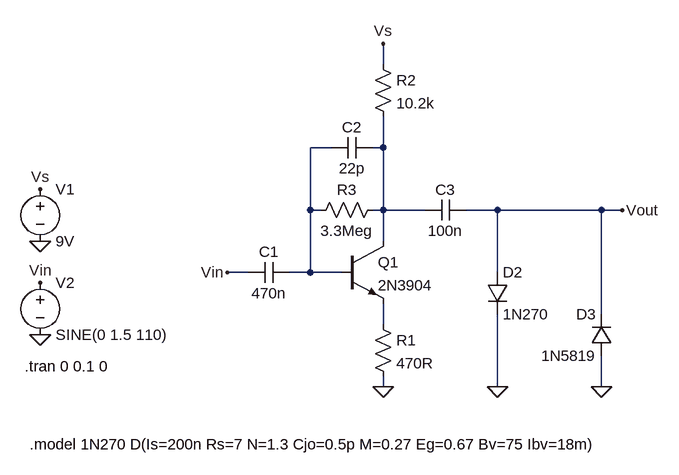
[diagram p0: schematic Electra_2.asc]
Electra_2.asc, the LTspice schematic file:
Version 4.1
SHEET 1 1988 680
WIRE 528 -32 528 -64
WIRE 448 96 416 96
WIRE 528 96 528 48
WIRE 528 96 512 96
WIRE 416 192 416 96
WIRE 432 192 416 192
WIRE 528 192 528 96
WIRE 528 192 512 192
WIRE 592 192 528 192
WIRE 704 192 656 192
WIRE 864 192 704 192
WIRE 896 192 864 192
WIRE 528 240 528 192
WIRE 320 288 288 288
WIRE 416 288 416 192
WIRE 416 288 384 288
WIRE 464 288 416 288
WIRE 704 288 704 192
WIRE 864 352 864 192
WIRE 528 368 528 336
WIRE 528 464 528 448
WIRE 704 464 704 352
WIRE 864 464 864 416
FLAG 0 160 Vs
FLAG 0 240 0
FLAG 0 384 0
FLAG 0 304 Vin
FLAG 288 288 Vin
FLAG 528 464 0
FLAG 528 -64 Vs
FLAG 704 464 0
FLAG 864 464 0
FLAG 896 192 Vout
SYMBOL voltage 0 144 R0
WINDOW 123 0 0 Left 0
WINDOW 39 0 0 Left 0
SYMATTR InstName V1
SYMATTR Value 9V
SYMBOL voltage 0 288 R0
WINDOW 123 0 0 Left 0
WINDOW 39 0 0 Left 0
SYMATTR InstName V2
SYMATTR Value SINE(0 1.5 110)
SYMBOL cap 384 272 R90
WINDOW 0 0 32 VBottom 2
WINDOW 3 32 32 VTop 2
SYMATTR InstName C1
SYMATTR Value 470n
SYMBOL npn 464 240 R0
SYMATTR InstName Q1
SYMATTR Value 2N3904
SYMBOL res 512 352 R0
SYMATTR InstName R1
SYMATTR Value 470R
SYMBOL res 528 176 R90
WINDOW 0 0 56 VBottom 2
WINDOW 3 32 56 VTop 2
SYMATTR InstName R3
SYMATTR Value 3.3Meg
SYMBOL cap 512 80 R90
WINDOW 0 0 32 VBottom 2
WINDOW 3 32 32 VTop 2
SYMATTR InstName C2
SYMATTR Value 22p
SYMBOL cap 656 176 R90
WINDOW 0 0 32 VBottom 2
WINDOW 3 32 32 VTop 2
SYMATTR InstName C3
SYMATTR Value 100n
SYMBOL res 512 -48 R0
SYMATTR InstName R2
SYMATTR Value 10.2k
SYMBOL diode 880 416 R180
WINDOW 0 24 64 Left 2
WINDOW 3 24 0 Left 2
SYMATTR InstName D3
SYMATTR Value 1N5819
SYMATTR Description Diode
SYMATTR Type diode
SYMBOL diode 688 288 R0
SYMATTR InstName D2
SYMATTR Value 1N270
TEXT -24 432 Left 2 !.tran 0 0.1 0
TEXT -16 552 Left 2 !.model 1N270 D(Is=200n Rs=7 N=1.3 Cjo=0.5p M=0.27 Eg=0.67 Bv=75 Ibv=18m)

The netlist it stands for:
* Electra_2.asc
V1 Vs 0 9V
V2 Vin 0 SINE(0 1.5 110)
C1 N001 Vin 470n
Q1 N002 N001 N003 0 2N3904
R1 N003 0 470R
R3 N002 N001 3.3Meg
C2 N002 N001 22p
C3 Vout N002 100n
R2 Vs N002 10.2k
D3 0 Vout 1N5819
D2 Vout 0 1N270
.model D D
.lib standard.dio
.model NPN NPN
.model PNP PNP
.lib standard.bjt
.tran 0 0.1 0
.model 1N270 D(Is=200n Rs=7 N=1.3 Cjo=0.5p M=0.27 Eg=0.67 Bv=75 Ibv=18m)
.backanno
.end